# Altium schematic sheet [13]VIDEO_PORT.SchDoc
size A4
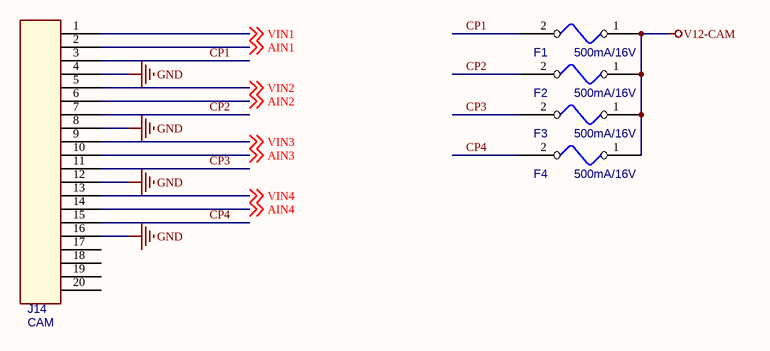
[diagram p0: [13]VIDEO_PORT.SchDoc]

## Parts
F1  500mA/16V  [1812]
F2  500mA/16V  [1812]
F3  500mA/16V  [1812]
F4  500mA/16V  [1812]
J14  CAM  [CONN2X10]

## Nets
GND: J14.4 J14.8 J14.12 J14.16
V12-CAM: F1.1 F2.1 F3.1 F4.1
AIN1: J14.2 ; off-sheet AIN1
AIN2: J14.6 ; off-sheet AIN2
AIN3: J14.10 ; off-sheet AIN3
AIN4: J14.14 ; off-sheet AIN4
CP1: F1.2 J14.3
CP2: F2.2 J14.7
CP3: F3.2 J14.11
CP4: F4.2 J14.15
VIN1: J14.1 ; off-sheet VIN1
VIN2: J14.5 ; off-sheet VIN2
VIN3: J14.9 ; off-sheet VIN3
VIN4: J14.13 ; off-sheet VIN4

Not connected (* = marked no-connect by the designer): J14 17 18 19 20

## Library data of the parts
F1-F4 = 2A_32VDC_0467-002
J14 = CON20